# Altium project noise_toaster.PrjPcb (part 2 of 3)

## Sheet VCLPF.SchDoc
size A4
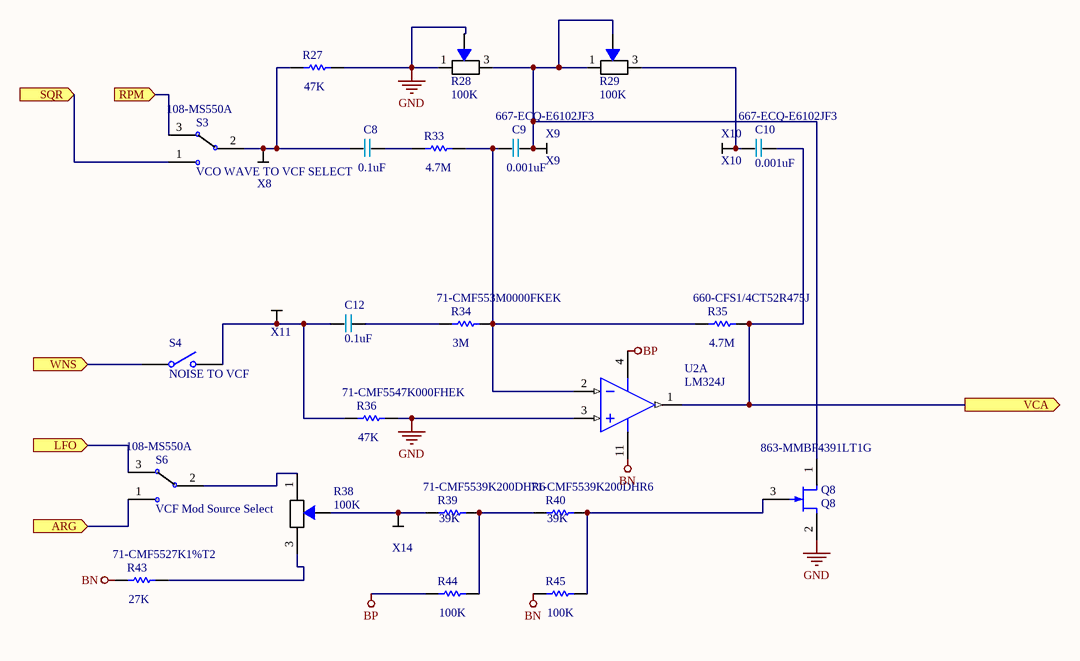
[diagram p3: VCLPF.SchDoc]

### Parts
C8  0.1uF  [Cap Film 5]
C9  Supplier Part Number 1: 667-ECQ-E6102JF3  [Cap Film 5]  (hidden comment: 0.001uF)
C10  Supplier Part Number 1: 667-ECQ-E6102JF3  [Cap Film 5]  (hidden comment: 0.001uF)
C12  0.1uF  [Cap Film 5]
Q8  Q8  Supplier Part Number 2: 863-MMBF4391LT1G  [ONSC-SOT-23-3-318-08_V]
R27  47K  [AXIAL-0.3]
R28  100K  [Potentiometer]
R29  100K  [Potentiometer]
R33  4.7M  [AXIAL-0.3]
R34  Supplier Part Number 1: 71-CMF553M0000FKEK  [AXIAL-0.3]  (hidden comment: 3M)
R35  Supplier Part Number 1: 660-CFS1/4CT52R475J  [AXIAL-0.3]  (hidden comment: 4.7M)
R36  Supplier Part Number 1: 71-CMF5547K000FHEK  [AXIAL-0.3]  (hidden comment: 47K)
R38  100K  [Potentiometer]
R39  Supplier Part Number 1: 71-CMF5539K200DHR6  [AXIAL-0.3]  (hidden comment: 39K)
R40  Supplier Part Number 1: 71-CMF5539K200DHR6  [AXIAL-0.3]  (hidden comment: 39K)
R43  Supplier Part Number 1: 71-CMF5527K1%T2  [AXIAL-0.3]  (hidden comment: 27K)
R44  100K  [AXIAL-0.3]
R45  100K  [AXIAL-0.3]
S3  VCO WAVE TO VCF SELECT  Supplier Part Number 1: 108-MS550A  [SPDT Switch]
S4  NOISE TO VCF  [SPST-2]
S6  VCF Mod Source Select  Supplier Part Number 1: 108-MS550A  [SPDT Switch]
U2  LM324J  [J14A]  (part A of 4)
X8  Pad  [Pad]  (value not drawn)
X9  X9  [Pad]
X10  X10  [Pad]
X11  X11  [Pad]  (value not drawn)
X14  X14  [Pad]  (value not drawn)

### Ports
ARG (in), LFO (in), RPM (in), SQR (in), VCA (out), WNS (in)

### Nets
BN: R43.1 R45.1 U2.11(GND)
BP: R44.1 U2.4(V+)
GND: Q8.2(S) R27.2 R28.1 R28.2 R36.2 U2.3(IN1+)
NetC2_1: S3.3 ; port RPM
NetC8_1: C8.1 R27.1 S3.2 X8.1
NetC8_2: C8.2 R33.1
NetC9_1: C9.1 R33.2 R34.2 R35.1 U2.2(IN1-)
NetC9_2: C9.2 Q8.1(D) R28.3 R29.1 R29.2 X9.1
NetC10_1: C10.1 R29.3 X10.1
NetC10_2: C10.2 R35.2 U2.1(OUT1) ; port VCA
NetC12_1: C12.1 R36.1 S4.2(NO) X11.1
NetC12_2: C12.2 R34.1
NetQ6_3: S4.1(COMMON) ; port WNS
NetQ8_3: Q8.3(G) R40.2 R45.2
NetQ9_2: S6.1 ; port ARG
NetR13_1: S6.3 ; port LFO
NetR31_2: S3.1 ; port SQR
NetR38_1: R38.1 S6.2
NetR38_2: R38.2 R39.1 X14.1
NetR38_3: R38.3 R43.2
NetR39_2: R39.2 R40.1 R44.2

### Library data of the parts
C8 C12 = Cap Film 5: Value: 0.1uF; Supplier 1: Mouser; Supplier Part Number 1: 594-K104K20X7RH53K2
C9 = Cap Film 5: Manufacturer: Panasonic; Manufacturer Part Number: ECQ-E4103KF; Capacitance: 0.01 uF; Tolerance: 5 %; Type: Metallized Polyester Film Capacitor; Voltage Rating DC: 400 VDC; Capacitance - nF: 10 nF; Capacitance - pF: 10000 pF; Dielectric: Polyester; Lead Diameter: 0.6 mm; Value: 0.001uF; Supplier 1: Mouser; RoHS: RoHS Compliant; Category: Film Capacitors; Stock 1: 175429; Pricing 1: 1=0.360, 10=0.173, 100=0.123, 500=0.111, 1000=0.093, 2000=0.088, 10000=0.077, 25000=0.074, 50000=0.066 (USD); Height: 7.4 mm; Length: 10.3 mm; Packaging: Bulk; Product: General Film Capacitors; Series: ECQE(B); Termination Style: Radial; Width: 4.3 mm; Brand: Panasonic; Lead Spacing: 7.5 mm; Maximum Operating Temperature: + 105 C; Minimum Operating Temperature: - 40 C; Standard Pack Qty: 1000; RoHS - Mouser: Y; Minimum Order Quantity: 1; Reeling: False; ComponentLink1URL: http://www.mouser.com/ds/2/315/ABD0000C179-947645.pdf; ComponentLink1Description: http://www.mouser.com/ds/2/315/ABD0000C179-947645.pdf
C10 = Cap Film 5: Manufacturer: Panasonic; Manufacturer Part Number: ECQ-E6102JF3; Capacitance: 1000 pF; Tolerance: 5 %; Type: Metallized Polyester Film Capacitor; Voltage Rating DC: 630 VDC; Capacitance - nF: 1 nF; Dielectric: Polyester; Lead Diameter: 0.6 mm; Value: 0.001uF; Supplier 1: Mouser; RoHS: RoHS Compliant; Category: Film Capacitors; Stock 1: 1487; Pricing 1: 1=0.500, 10=0.244, 100=0.174, 500=0.157, 1000=0.132, 2000=0.118, 10000=0.108, 25000=0.105, 50000=0.093 (USD); Length: 10 mm; Product: General Film Capacitors; Series: ECQE(B); Termination Style: Radial; Width: 4.5 mm; Brand: Panasonic; Number of Pins: 2; Capacitance - uF: 0.001 uF; Lead Spacing: 5 mm; Maximum Operating Temperature: + 105 C; Minimum Operating Temperature: - 40 C; Standard Pack Qty: 1000; RoHS - Mouser: Y; Minimum Order Quantity: 1; Reeling: False; ComponentLink1URL: http://www.mouser.com/ds/2/315/ABD0000C179-947645.pdf; ComponentLink1Description: http://www.mouser.com/ds/2/315/ABD0000C179-947645.pdf
Q8 = MMBF4391LT1: JFET Switching Transistor, N-Channel, 3-Pin SOT-23, Tape and Reel; Manufacturer: On Semiconductor; Manufacturer Part Number: MMBF4391LT1G; Channel Polarity: N Channel; Ciss Max (pF): 14; Crss Max (pF): 3.5; IDSS Max (uA): 150000; IDSS Min (uA): 50000; V(BR)GSS Min (V): 30; Configuration: Single; Drain-Source Current at Vgs=0: 50 mA to 150 mA; Vds - Drain-Source Breakdown Voltage: 30 V; DatasheetVersion: Rev. 10; PackageVersion: Rev. AP, 11/2009; PackageReference: SOT-23-3-318-08; PackageDescription: 3-Pin Small Outline Transistor, Body 2.92 x 1.3 mm, Pitch 0.95 mm; Supplier 1: Mouser; Supplier Part Number 1: 863-MMBF4391LT1G; Packing: Tape and Reel; Mounting Technology: Surface Mount; PartNumber: MMBF4391LT1; ComponentLink1Description: Manufacturer URL; ComponentLink1URL: http://www.onsemi.com/; ComponentLink2Description: Datasheet; ComponentLink2URL: http://www.onsemi.com/pub_link/Collateral/MMBF4391LT1-D.PDF; ComponentLink3Description: Package Specification; ComponentLink3URL: http://www.onsemi.cn/pub_link/Collateral/318-08.PDF; Supplier 2: Mouser; RoHS: RoHS Compliant; Category: JFET; Stock 2: 3330; Pricing 2: 1=0.490, 10=0.339, 100=0.156, 1000=0.120, 3000=0.102, 9000=0.093, 24000=0.087, 45000=0.078, 99000=0.075 (USD); Package / Case: SOT-23-3; Packaging: Reel; Series: MMBF4391L; Brand: ON Semiconductor; Mounting Style: SMD/SMT; Transistor Polarity: N-Channel; Standard Pack Qty: 3000; Vgs - Gate-Source Breakdown Voltage: 30 V; RoHS - Mouser: Y; Minimum Order Quantity: 1; Reeling: True; ComponentLink4URL: http://www.mouser.com/ds/2/308/MMBF4391LT1-D-108578.pdf; ComponentLink4Description: http://www.mouser.com/ds/2/308/MMBF4391LT1-D-108578.pdf
R27 = Res1: Resistor; Manufacturer Part Number: CMF5547K000FHEK; Lead Diameter: 0.64 mm; Published: 8-Jun-2000; LatestRevisionDate: 17-Jul-2002; LatestRevisionNote: Re-released for DXP Platform.; PackageReference: AXIAL-0.3; Publisher: Altium Limited; PackageDescription: Axial Device, Thru-Hole; 2 Leads; 0.3 in Pin Spacing; Value: 47K; Category: Metal Film Resistors - Through Hole; ComponentLink1Description: http://www.mouser.com/ds/2/427/cmfind-239942.pdf; ComponentLink1URL: http://www.mouser.com/ds/2/427/cmfind-239942.pdf; Diameter: 2.29 mm; Supplier 1: Mouser; Supplier Part Number 1: 71-CMF5547K000FHEK
R28 R29 R38 = Potentiometer: My Own; Manufacturer Part Number: RV09AF-40-20K-B100K; Brand: Alpha (Taiwan); Number of Gangs: 1 Gang; Number of Turns: 1 Turn; Power Rating: 100 mW; Resistance: 100 kOhms; Shaft Diameter: 6 mm; Shaft Length: 20 mm; Shaft Type: Knurled / Serrated; Tolerance: 20 %; Voltage Rating: 50 V; Value: 100K; Category: Potentiometers; Manufacturer: Alpha (Taiwan); Minimum Order Quantity: 1; Mounting Style: Panel Mount; Operating Temperature Range: - 10 C to + 70 C; Pricing 1: 1=1.32, 25=1.11, 50=1.03, 100=0.940, 500=0.790, 1000=0.660, 2500=0.550, 5000=0.500, 10000=0.450 (USD); Product: Potentiometer; Reeling: False; RoHS - Mouser: Y; RoHS: RoHS Compliant; Standard Pack Qty: 1000; Stock 1: 13035; Supplier 1: Mouser; Supplier Part Number 1: 317-2090F-100K; Taper: Linear; Termination Style: Through Hole; Type: Rotary
R33 = Res1: Resistor; Published: 8-Jun-2000; LatestRevisionDate: 17-Jul-2002; LatestRevisionNote: Re-released for DXP Platform.; PackageReference: AXIAL-0.3; Publisher: Altium Limited; PackageDescription: Axial Device, Thru-Hole; 2 Leads; 0.3 in Pin Spacing; Value: 4.7M; Supplier 1: Mouser; Supplier Part Number 1: 660-CFS1/4CT52R475J
R34 = Res1: Resistor; Manufacturer: Vishay / Dale; Manufacturer Part Number: CMF553M0000FKEK; Power Rating: 500 mW (1/2 W); Resistance: 3 MOhms; Temperature Coefficient: 100 PPM / C; Tolerance: 1 %; Voltage Rating: 250 V; Lead Diameter: 0.64 mm; Published: 8-Jun-2000; LatestRevisionDate: 17-Jul-2002; LatestRevisionNote: Re-released for DXP Platform.; PackageReference: AXIAL-0.3; Publisher: Altium Limited; PackageDescription: Axial Device, Thru-Hole; 2 Leads; 0.3 in Pin Spacing; Value: 3M; Supplier 1: Mouser; RoHS: RoHS Compliant; Category: Metal Film Resistors - Through Hole; Stock 1: 575; Pricing 1: 1=0.510, 50=0.503, 100=0.493, 500=0.481, 1000=0.418, 2000=0.405, 5000=0.393, 10000=0.381, 25000=0.380 (USD); Diameter: 2.29 mm; Length: 6.1 mm; Operating Temperature Range: - 55 C to + 175 C; Packaging: Bulk; Product: Metal Film Resistors Controlled Temp Coefficient; Series: CMF Industrial; Termination Style: Axial; Type: Metal Film Resistors, Industrial, Precision; Brand: Vishay / Dale; Standard Pack Qty: 100; RoHS - Mouser: Y; Minimum Order Quantity: 1; Reeling: False; ComponentLink1URL: http://www.mouser.com/ds/2/427/cmfind-239942.pdf; ComponentLink1Description: http://www.mouser.com/ds/2/427/cmfind-239942.pdf
R35 = Res1: Resistor; Manufacturer: KOA Speer; Manufacturer Part Number: CFS1/4CT52R475J; Power Rating: 250 mW (1/4 W); Resistance: 4.7 MOhms; Tolerance: 5 %; Voltage Rating: 250 V; Qualification: AEC-Q200; Published: 8-Jun-2000; LatestRevisionDate: 17-Jul-2002; LatestRevisionNote: Re-released for DXP Platform.; PackageReference: AXIAL-0.3; Publisher: Altium Limited; PackageDescription: Axial Device, Thru-Hole; 2 Leads; 0.3 in Pin Spacing; Value: 4.7M; Supplier 1: Mouser; RoHS: RoHS Compliant; Category: Carbon Film Resistors - Through Hole; Stock 1: 14824; Pricing 1: 1=0.150, 5000=0.030, 10000=0.018, 50000=0.014, 100000=0.010 (USD); Diameter: 1.7 mm; Length: 3.2 mm; Operating Temperature Range: - 55 C to + 155 C; Packaging: Reel; Series: CF; Termination Style: Axial; Type: Carbon Film Leaded Resistor; Brand: KOA Speer; Standard Pack Qty: 5000; RoHS - Mouser: Y; Minimum Order Quantity: 1; Reeling: True; ComponentLink1URL: http://www.mouser.com/ds/2/219/CF-6922.pdf; ComponentLink1Description: http://www.mouser.com/ds/2/219/CF-6922.pdf
R36 = Res1: Resistor; Manufacturer: Vishay / Dale; Manufacturer Part Number: CMF5547K000FHEK; Power Rating: 500 mW (1/2 W); Resistance: 47 kOhms; Temperature Coefficient: 50 PPM / C; Tolerance: 1 %; Voltage Rating: 250 V; Lead Diameter: 0.64 mm; Published: 8-Jun-2000; LatestRevisionDate: 17-Jul-2002; LatestRevisionNote: Re-released for DXP Platform.; PackageReference: AXIAL-0.3; Publisher: Altium Limited; PackageDescription: Axial Device, Thru-Hole; 2 Leads; 0.3 in Pin Spacing; Value: 47K; Supplier 1: Mouser; RoHS: RoHS Compliant; Category: Metal Film Resistors - Through Hole; Stock 1: 569; Pricing 1: 1=0.420, 25=0.242, 100=0.152, 500=0.131, 1000=0.100, 2000=0.093, 5000=0.084 (USD); Diameter: 2.29 mm; Length: 6.1 mm; Operating Temperature Range: - 55 C to + 175 C; Packaging: Bulk; Product: Metal Film Resistors Controlled Temp Coefficient; Series: CMF Industrial; Termination Style: Axial; Type: Metal Film Resistors, Industrial, Precision; Brand: Vishay / Dale; Standard Pack Qty: 100; RoHS - Mouser: Y; Minimum Order Quantity: 1; Reeling: False; ComponentLink1URL: http://www.mouser.com/ds/2/427/cmfind-239942.pdf; ComponentLink1Description: http://www.mouser.com/ds/2/427/cmfind-239942.pdf
R39 R40 = Res1: Resistor; Manufacturer: Vishay / Dale; Manufacturer Part Number: CMF5539K200DHR6; Power Rating: 500 mW (1/2 W); Resistance: 39.2 kOhms; Temperature Coefficient: 50 PPM / C; Tolerance: 0.5 %; Voltage Rating: 250 V; Published: 8-Jun-2000; LatestRevisionDate: 17-Jul-2002; LatestRevisionNote: Re-released for DXP Platform.; PackageReference: AXIAL-0.3; Publisher: Altium Limited; PackageDescription: Axial Device, Thru-Hole; 2 Leads; 0.3 in Pin Spacing; Value: 39K; Supplier 1: Mouser; RoHS: No; Category: Metal Film Resistors - Through Hole; Stock 1: 502; Pricing 1: 1=0.230, 50=0.225, 100=0.220, 500=0.193, 1000=0.181, 4000=0.171, 8000=0.160, 12000=0.146, 20000=0.135 (USD); Diameter: 2.29 mm; Length: 6.1 mm; Operating Temperature Range: - 55 C to + 175 C; Packaging: Reel; Product: Metal Film Resistors Controlled Temp Coefficient; Series: CMF Industrial; Termination Style: Axial; Type: Metal Film Resistors, Industrial, Precision; Brand: Vishay / Dale; Standard Pack Qty: 1000; RoHS - Mouser: N; Minimum Order Quantity: 1; Reeling: True; ComponentLink1URL: http://www.mouser.com/ds/2/427/cmfind-239942.pdf; ComponentLink1Description: http://www.mouser.com/ds/2/427/cmfind-239942.pdf
R43 = Res1: Resistor; Manufacturer: Vishay / Dale; Manufacturer Part Number: CMF5527K000FHBF; Power Rating: 500 mW (1/2 W); Resistance: 27 kOhms; Temperature Coefficient: 50 PPM / C; Tolerance: 1 %; Voltage Rating: 250 V; Lead Diameter: 0.64 mm; Published: 8-Jun-2000; LatestRevisionDate: 17-Jul-2002; LatestRevisionNote: Re-released for DXP Platform.; PackageReference: AXIAL-0.3; Publisher: Altium Limited; PackageDescription: Axial Device, Thru-Hole; 2 Leads; 0.3 in Pin Spacing; Value: 27K; Supplier 1: Mouser; RoHS: No; Category: Metal Film Resistors - Through Hole; Stock 1: 827; Pricing 1: 1=0.230, 100=0.179, 300=0.168, 500=0.158, 1000=0.120, 2000=0.110, 11000=0.090, 23000=0.080 (USD); Diameter: 2.29 mm; Length: 6.1 mm; Operating Temperature Range: - 55 C to + 175 C; Packaging: Bulk; Product: Metal Film Resistors Controlled Temp Coefficient; Series: CMF Industrial; Termination Style: Axial; Type: Metal Film Resistors, Industrial, Precision; Brand: Vishay / Dale; Standard Pack Qty: 100; RoHS - Mouser: N; Minimum Order Quantity: 1; Reeling: False; ComponentLink1URL: http://www.mouser.com/ds/2/427/cmfind-239942.pdf; ComponentLink1Description: http://www.mouser.com/ds/2/427/cmfind-239942.pdf
R44 R45 = Res1: Resistor; Manufacturer Part Number: CMF55100K00FHEK; Brand: Vishay / Dale; Lead Diameter: 0.64 mm; Power Rating: 500 mW (1/2 W); Resistance: 100 kOhms; Temperature Coefficient: 50 PPM / C; Tolerance: 1 %; Voltage Rating: 250 V; Published: 8-Jun-2000; LatestRevisionDate: 17-Jul-2002; LatestRevisionNote: Re-released for DXP Platform.; PackageReference: AXIAL-0.3; Publisher: Altium Limited; PackageDescription: Axial Device, Thru-Hole; 2 Leads; 0.3 in Pin Spacing; Value: 100K; Category: Metal Film Resistors - Through Hole; ComponentLink1Description: http://www.mouser.com/ds/2/427/cmfind-239942.pdf; ComponentLink1URL: http://www.mouser.com/ds/2/427/cmfind-239942.pdf; Diameter: 2.29 mm; Length: 6.1 mm; Manufacturer: Vishay / Dale; Minimum Order Quantity: 1; Operating Temperature Range: - 55 C to + 175 C; Packaging: Bulk; Pricing 1: 1=0.230, 25=0.181, 100=0.132, 500=0.115, 1000=0.099, 2000=0.092, 5000=0.087, 10000=0.082, 25000=0.072 (USD); Product: Metal Film Resistors Controlled Temp Coefficient; Reeling: False; RoHS - Mouser: Y; RoHS: RoHS Compliant; Series: CMF Industrial; Standard Pack Qty: 100; Stock 1: 4041; Supplier 1: Mouser; Supplier Part Number 1: 71-CMF55100K00FHEK; Termination Style: Axial; Type: Metal Film Resistors, Industrial, Precision; Supplier Part Number 2: 71-CMF55100K00BEEB
S3 S6 = SPDT Switch: Manufacturer: Mountain Switch; Actuator: Paddle; Bushing Size: M6; Switch Function: ON - ON; Voltage Rating AC: 125 VAC; Product Status: Not Recommended for New Designs; Supplier 1: Mouser; Manufacturer Part Number: 108-MS550A; RoHS: No; Category: Toggle Switches; Stock 1: 531; Pricing 1: 1=2.15, 50=2.09, 100=2.03, 500=1.97, 1000=1.80, 2000=1.71, 5000=1.63 (USD); Contact Form: SPDT; Contact Plating: Gold; Mounting Type: Bushing; Packaging: Bulk; Series: 108; Terminal Seal: Sealed; Termination Style: Solder Lug; Type: Toggle Switches; Brand: Mountain Switch; Contact Material: Nickel; Mounting Style: Panel; Standard Pack Qty: 100; RoHS - Mouser: N; Minimum Order Quantity: 1; Reeling: False; ComponentLink1URL: http://www.mouser.com/ds/2/221/MS-200272-200731.pdf; ComponentLink1Description: http://www.mouser.com/ds/2/221/MS-200272-200731.pdf
S4 = SW-SPST: Single-Pole, Single-Throw Switch; Published: 24-Mar-1999; LatestRevisionDate: 17-Jul-2002; LatestRevisionNote: Re-released for DXP Platform.; PackageReference: SPST-2; Publisher: Altium Limited; PackageDescription: Switch; 2 Leads; Supplier 1: Mouser; Supplier Part Number 1: 108-MS550K
U2 = LM324J: Low Power Quad Operational Amplifier, 14-pin CerDIP; Manufacturer: National Semiconductor; PackageTopMarking: NSUZXYYTT*LM324J; PowerWise: N; CompType: Amplifiers; High-Reliability: Y; DatasheetVersion: Aug-2000; PackageVersion: revJ, Jul-2002; PackageReference: J14A; PackageDescription: Cerdip, .400 x .310in Body, 14 Lead, .300in Centers, .100in Pitch; PartNumber: LM324J; RoHS: N; PinCount: 14; ComponentLink1Description: Manufacturer URL; ComponentLink1URL: http://www.national.com/; ComponentLink2Description: LM324 Datasheet; ComponentLink2URL: http://www.national.com/ds/LM/LM324.pdf; ComponentLink3Description: LM324 Web Page; ComponentLink3URL: http://www.national.com/pf/LM/LM324.html; ComponentLink4Description: J14A Package Page; ComponentLink4URL: http://www.national.com/packaging/folders/j14a.html; Supplier 1: Mouser; Supplier Part Number 1: 512-LM324N
X9-X11 X14 = Pad

## Sheet LFO.SchDoc
size A4
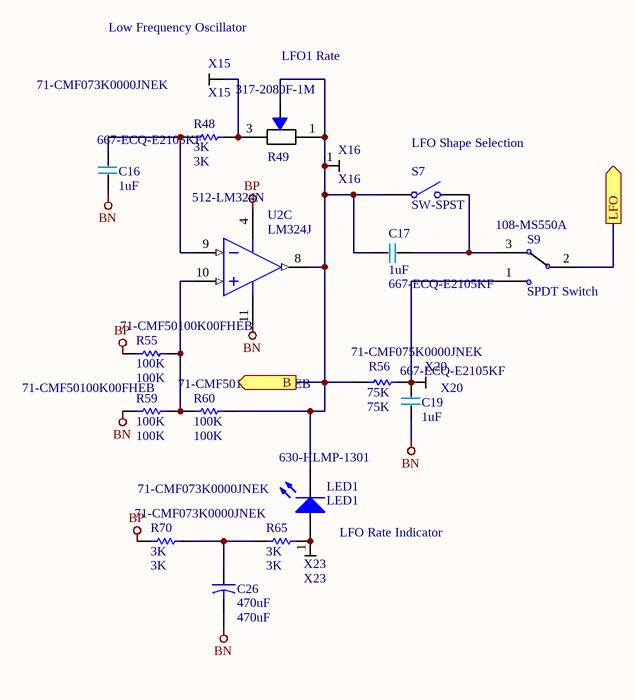
[diagram p4: LFO.SchDoc]

### Parts
C16  Supplier Part Number 1: 667-ECQ-E2105KF  [Cap Film 5]  (hidden comment: 1uF)
C17  Supplier Part Number 1: 667-ECQ-E2105KF  [Cap Film 5]  (hidden comment: 1uF)
C19  Supplier Part Number 1: 667-ECQ-E2105KF  [Cap Film 5]  (hidden comment: 1uF)
C26  470uF  [CAPR5-4X5]
LED1  LED1  Supplier Part Number 1: 630-HLMP-1301  [LED-0]
R48  3K  Supplier Part Number 1: 71-CMF073K0000JNEK  [AXIAL-0.3]
R49  Supplier Part Number 1: 317-2080F-1M  [Potentiometer]  (hidden comment: 1M)
R55  100K  Supplier Part Number 2: 71-CMF50100K00FHEB  [AXIAL-0.3]
R56  75K  Supplier Part Number 1: 71-CMF075K0000JNEK  [AXIAL-0.3]
R59  100K  Supplier Part Number 2: 71-CMF50100K00FHEB  [AXIAL-0.3]
R60  100K  Supplier Part Number 2: 71-CMF50100K00FHEB  [AXIAL-0.3]
R65  3K  Supplier Part Number 1: 71-CMF073K0000JNEK  [AXIAL-0.3]
R70  3K  Supplier Part Number 1: 71-CMF073K0000JNEK  [AXIAL-0.3]
S7  SW-SPST  [SPST-2]
S9  SPDT Switch  Supplier Part Number 1: 108-MS550A  [SPDT Switch]
U2  LM324J  Supplier Part Number 1: 512-LM324N  [J14A]  (part C of 4)
X15  X15  [Pad]
X16  X16  [Pad]
X20  X20  [Pad]
X23  X23  [Pad]

### Ports
B (out), LFO (out)

### Nets
BN: C16.1 C19.1 C26.2 R59.1 U2.11(GND)
BP: R55.1 R70.1 U2.4(V+)
NetC16_2: C16.2 R48.1 U2.9(IN3-)
NetC17_1: C17.1 S7.2(NO) S9.3
NetC17_2: C17.2 LED1.2(K) R49.1 R49.2 R56.1 R60.2 S7.1(COMMON) U2.8(OUT3) X16.1 ; port B
NetC19_2: C19.2 R56.2 S9.1 X20.1
NetC26_1: C26.1 R65.1 R70.2
NetLED1_1: LED1.1(A) R65.2 X23.1
NetR13_1: S9.2 ; port LFO
NetR48_2: R48.2 R49.3 X15.1
NetR55_2: R55.2 R59.2 R60.1 U2.10(IN3+)

### Notes on the sheet
- (near X15) Low Frequency Oscillator
- LFO1 Rate
- (near S7) LFO Shape Selection
- LFO Rate Indicator

### Library data of the parts
C16 C17 C19 = Cap Film 5: Manufacturer: Panasonic; Manufacturer Part Number: ECQ-E2105KF; Tolerance: 10 %; Type: Metallized Polyester Film Capacitor; Voltage Rating DC: 250 VDC; Capacitance - nF: 1000 nF; Dielectric: Polyester; Lead Diameter: 0.8 mm; Value: 1uF; Supplier 1: Mouser; RoHS: RoHS Compliant; Category: Film Capacitors; Stock 1: 10797; Pricing 1: 1=0.680, 10=0.361, 100=0.268, 500=0.233, 1000=0.198, 2000=0.186, 10000=0.160, 25000=0.157, 50000=0.150 (USD); Capacitance: 1 uF; Height: 15 mm; Length: 18.5 mm; Packaging: Bulk; Product: General Film Capacitors; Series: ECQE(B); Termination Style: Radial; Width: 7.4 mm; Brand: Panasonic; Lead Spacing: 15 mm; Maximum Operating Temperature: + 105 C; Minimum Operating Temperature: - 40 C; Standard Pack Qty: 1000; RoHS - Mouser: Y; Minimum Order Quantity: 1; Reeling: False; ComponentLink1URL: http://www.mouser.com/ds/2/315/ABD0000C179-947645.pdf; ComponentLink1Description: http://www.mouser.com/ds/2/315/ABD0000C179-947645.pdf
C26 = Cap2: Capacitor; Value: 470uF; Published: 23-Sep-2002; PackageReference: CAPR5-4X5; Publisher: Altium Limited; PackageDescription: Capacitor; 2 Leads; Supplier 1: Mouser; Supplier Part Number 1: 667-ECA-1VM471
LED1 = LED0: Typical INFRARED GaAs LED; Manufacturer: Broadcom / Avago; Illumination Color: Red; Lens Color/Style: Tinted, Diffused; Wavelength: 635 nm; LED Size: T-1 (3 mm); Lens Shape: Dome; Luminous Intensity: 3.4 mcd; Viewing Angle: 60 deg; If - Forward Current: 10 mA; Operating Supply Voltage: 1.9 V; Published: 8-Jun-2000; LatestRevisionDate: 08-Jul-2005; LatestRevisionNote: Mech Layer 1 removed.; PackageReference: LED-0; Publisher: Altium Limited; PackageDescription: LED; 2 Leads; Supplier 1: Mouser; Manufacturer Part Number: HLMP-1301; RoHS: RoHS Compliant; Category: Standard LEDs - Through Hole; Stock 1: 32479; Pricing 1: 1=0.370, 10=0.240, 100=0.138, 1000=0.108, 2000=0.090, 10000=0.084, 24000=0.082, 50000=0.079, 100000=0.075 (USD); Package / Case: T-1 (3 mm); Packaging: Bulk; Brand: Broadcom / Avago; Mounting Style: Through Hole; Lens Dimensions: 3 mm; Maximum Operating Temperature: + 100 C; Minimum Operating Temperature: - 40 C; Standard Pack Qty: 2000; Vf - Forward Voltage: 1.9 V; Wavelength/Color Temperature: 635 nm; RoHS - Mouser: Y; Minimum Order Quantity: 1; Reeling: False
R48 R65 R70 = Res1: Resistor; Manufacturer: Vishay / Dale; Manufacturer Part Number: CMF073K0000JNEK; Power Rating: 500 mW (1/2 W); Resistance: 3 kOhms; Temperature Coefficient: 200 PPM / C; Tolerance: 5 %; Voltage Rating: 250 V; Lead Diameter: 0.64 mm; Published: 8-Jun-2000; LatestRevisionDate: 17-Jul-2002; LatestRevisionNote: Re-released for DXP Platform.; PackageReference: AXIAL-0.3; Publisher: Altium Limited; PackageDescription: Axial Device, Thru-Hole; 2 Leads; 0.3 in Pin Spacing; Value: 3K; Supplier 1: Mouser; RoHS: RoHS Compliant; Category: Metal Film Resistors - Through Hole; Stock 1: 1543; Pricing 1: 1=0.450, 25=0.324, 50=0.198, 100=0.147, 500=0.106, 1000=0.082, 2500=0.078, 5000=0.077, 10000=0.075 (USD); Diameter: 2.29 mm; Length: 6.1 mm; Operating Temperature Range: - 55 C to + 175 C; Packaging: Bulk; Product: Metal Film Resistors Controlled Temp Coefficient; Series: CMF Industrial; Termination Style: Axial; Type: Metal Film Resistors, Industrial, Precision; Brand: Vishay / Dale; Standard Pack Qty: 100; RoHS - Mouser: Y; Minimum Order Quantity: 1; Reeling: False; ComponentLink1URL: http://www.mouser.com/ds/2/427/cmfind-239942.pdf; ComponentLink1Description: http://www.mouser.com/ds/2/427/cmfind-239942.pdf
R49 = Potentiometer: My Own; Manufacturer: Alpha (Taiwan); Manufacturer Part Number: RV09AF-40-20K-A16; Power Rating: 50 mW; Resistance: 1 MOhms; Tolerance: 20 %; Voltage Rating: 50 V; Number of Gangs: 1 Gang; Number of Turns: 1 Turn; Shaft Diameter: 6 mm; Shaft Length: 20 mm; Shaft Type: Knurled / Serrated; Supplier 1: Mouser; RoHS: RoHS Compliant; Category: Potentiometers; Stock 1: 740; Pricing 1: 1=1.32, 25=1.11, 50=1.03, 100=0.940, 500=0.790, 1000=0.660, 2500=0.550, 5000=0.500, 10000=0.450 (USD); Operating Temperature Range: - 10 C to + 70 C; Product: Potentiometer; Termination Style: Through Hole; Type: Rotary; Brand: Alpha (Taiwan); Mounting Style: Panel Mount; Standard Pack Qty: 1000; Taper: Audio; RoHS - Mouser: Y; Minimum Order Quantity: 1; Reeling: False; Value: 1M
R55 R59 R60 = Res1: as R44 on sheet VCLPF; Published: 8-Jun-2000; LatestRevisionDate: 17-Jul-2002; LatestRevisionNote: Re-released for DXP Platform.; PackageReference: AXIAL-0.3; Publisher: Altium Limited; PackageDescription: Axial Device, Thru-Hole; 2 Leads; 0.3 in Pin Spacing; Value: 100K; Category: Metal Film Resistors - Through Hole; ComponentLink1Description: http://www.mouser.com/ds/2/427/cmfind-239942.pdf; ComponentLink1URL: http://www.mouser.com/ds/2/427/cmfind-239942.pdf; Diameter: 2.29 mm; Length: 6.1 mm; Manufacturer: Vishay / Dale; Minimum Order Quantity: 1; Operating Temperature Range: - 55 C to + 175 C; Packaging: Bulk; Pricing 1: 1=0.230, 25=0.181, 100=0.132, 500=0.115, 1000=0.099, 2000=0.092, 5000=0.087, 10000=0.082, 25000=0.072 (USD); Product: Metal Film Resistors Controlled Temp Coefficient; Reeling: False; RoHS - Mouser: Y; RoHS: RoHS Compliant; Series: CMF Industrial; Standard Pack Qty: 100; Stock 1: 4041; Supplier 1: Mouser; Supplier Part Number 1: 71-CMF50100K00FHEB; Termination Style: Axial; Type: Metal Film Resistors, Industrial, Precision; Stock 2: 935; Pricing 2: 1=0.770, 10=0.460, 50=0.400, 100=0.287, 500=0.233, 1000=0.168, 2000=0.163, 5000=0.160, 10000=0.153 (USD)
R56 = Res1: Resistor; Manufacturer: Yageo; Manufacturer Part Number: FMP200FRF52-75K; Power Rating: 500 mW (1/2 W); Resistance: 5 kOhms; Temperature Coefficient: 200 PPM / C; Tolerance: 5 %; Voltage Rating: 250 V; Brand: Vishay / Dale; Lead Diameter: 0.64 mm; Published: 8-Jun-2000; LatestRevisionDate: 17-Jul-2002; LatestRevisionNote: Re-released for DXP Platform.; PackageReference: AXIAL-0.3; Publisher: Altium Limited; PackageDescription: Axial Device, Thru-Hole; 2 Leads; 0.3 in Pin Spacing; Value: 75K; Supplier 1: Mouser; RoHS: RoHS Compliant; Category: Metal Film Resistors - Through Hole; Stock 1: 227; Pricing 1: 1=0.320, 25=0.300, 50=0.184, 100=0.116, 500=0.099, 1000=0.076, 2500=0.071, 5000=0.064 (USD); Diameter: 2.29 mm; Length: 6.1 mm; Operating Temperature Range: - 55 C to + 175 C; Packaging: Bulk; Product: Metal Film Resistors Controlled Temp Coefficient; Series: CMF Industrial; Termination Style: Axial; Type: Metal Film Resistors, Industrial, Precision; Standard Pack Qty: 100; RoHS - Mouser: Y; Minimum Order Quantity: 1; Reeling: False; ComponentLink1URL: http://www.mouser.com/ds/2/427/cmfind-239942.pdf; ComponentLink1Description: http://www.mouser.com/ds/2/427/cmfind-239942.pdf
S7 = SW-SPST: Single-Pole, Single-Throw Switch; Published: 24-Mar-1999; LatestRevisionDate: 17-Jul-2002; LatestRevisionNote: Re-released for DXP Platform.; PackageReference: SPST-2; Publisher: Altium Limited; PackageDescription: Switch; 2 Leads; Supplier 1: Mouser; Supplier Part Number 1: 108-MS550K
S9 = SPDT Switch: as S3 on sheet VCLPF; Supplier 1: Mouser; Manufacturer Part Number: 108-MS550A; RoHS: No; Category: Toggle Switches; Stock 1: 531; Pricing 1: 1=2.15, 50=2.09, 100=2.03, 500=1.97, 1000=1.80, 2000=1.71, 5000=1.63 (USD); Contact Form: SPDT; Contact Plating: Gold; Mounting Type: Bushing; Packaging: Bulk; Series: 108; Terminal Seal: Sealed; Termination Style: Solder Lug; Type: Toggle Switches; Brand: Mountain Switch; Contact Material: Nickel; Mounting Style: Panel; Standard Pack Qty: 100; RoHS - Mouser: N; Minimum Order Quantity: 1; Reeling: False; ComponentLink1URL: http://www.mouser.com/ds/2/221/MS-200272-200731.pdf; ComponentLink1Description: http://www.mouser.com/ds/2/221/MS-200272-200731.pdf
U2 = LM324J: Low Power Quad Operational Amplifier, 14-pin CerDIP; Manufacturer: National Semiconductor; Manufacturer Part Number: LM324N; PackageTopMarking: NSUZXYYTT*LM324J; PowerWise: N; CompType: Amplifiers; High-Reliability: Y; Amplifier Type: High Gain Amplifier; Input Type: Rail-to-Rail; Supply Type: Single, Dual; Brand: ON Semiconductor / Fairchild; Number of Channels: 4 Channel; Shutdown: No Shutdown; CMRR - Common Mode Rejection Ratio: 65 dB; Dual Supply Voltage: +/- 3 V, +/- 5 V, +/- 9 V; Ib - Input Bias Current: 250 nA; Maximum Dual Supply Voltage: +/- 16 V; Minimum Dual Supply Voltage: +/- 1.5 V; Operating Supply Current: 175 uA; Operating Supply Voltage: 3 V to 32 V, +/- 1.5 V to +/- 16 V; Output Current per Channel: 40 mA; Pd - Power Dissipation: 1310 mW; Supply Voltage - Max: 32 V; Supply Voltage - Min: 3 V; Voltage Gain dB: 100 dB; Vos - Input Offset Voltage: 7 mV; DatasheetVersion: Aug-2000; PackageVersion: revJ, Jul-2002; PackageReference: J14A; PackageDescription: Cerdip, .400 x .310in Body, 14 Lead, .300in Centers, .100in Pitch; PartNumber: LM324J; RoHS: N; PinCount: 14; ComponentLink1Description: Manufacturer URL; ComponentLink1URL: http://www.national.com/; ComponentLink2Description: LM324 Datasheet; ComponentLink2URL: http://www.national.com/ds/LM/LM324.pdf; ComponentLink3Description: LM324 Web Page; ComponentLink3URL: http://www.national.com/pf/LM/LM324.html; ComponentLink4Description: J14A Package Page; ComponentLink4URL: http://www.national.com/packaging/folders/j14a.html; Supplier 1: Mouser; Category: Operational Amplifiers - Op Amps; Stock 1: 11024; Pricing 1: 1=0.460, 10=0.380, 100=0.232, 1000=0.179, 2500=0.153, 10000=0.143, 25000=0.135, 50000=0.132 (USD); Height: 3.56 mm (Max); Length: 19.56 mm (Max); Package / Case: DIP-14; Packaging: Tube; Product: Operational Amplifiers; Series: LM324; Technology: Bipolar; Width: 6.6 mm (Max); Mounting Style: Through Hole; Maximum Operating Temperature: + 70 C; Minimum Operating Temperature: 0 C; PSRR - Power Supply Rejection Ratio: 65 dB; Standard Pack Qty: 25; RoHS - Mouser: Y; Minimum Order Quantity: 1; Reeling: False; ComponentLink5URL: http://www.mouser.com/ds/2/308/LM324-1120928.pdf; ComponentLink5Description: http://www.mouser.com/ds/2/308/LM324-1120928.pdf
X15 X16 X20 X23 = Pad

## Sheet attac_decay_generator.SchDoc
size A4
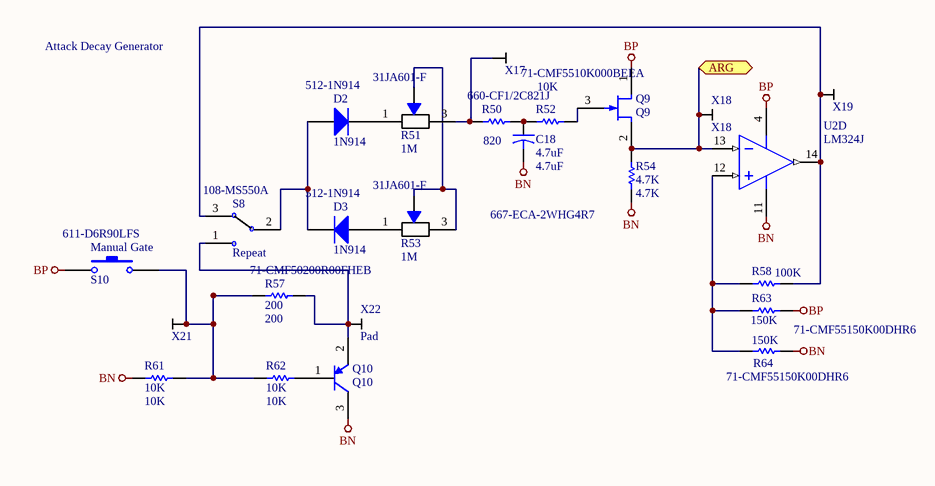
[diagram p5: attac_decay_generator.SchDoc]

### Parts
C18  4.7uF  Supplier Part Number 1: 667-ECA-2WHG4R7  [CAPR5-4X5]
D2  1N914  Supplier Part Number 1: 512-1N914  [DO-35]
D3  1N914  Supplier Part Number 1: 512-1N914  [DO-35]
Manual_Gate  S10  Supplier Part Number 1: 611-D6R90LFS  [SPST-2]
Q9  Q9  [ONSC-SOT-23-3-318-08_V]
Q10  Q10  [ONSC-SC-75-3-463-01_V]
R50  value 820  Supplier Part Number 1: 660-CF1/2C821J  [AXIAL-0.3]  (hidden comment: Res1820)
R51  value 1M  Supplier Part Number 1: 31JA601-F  [Potentiometer]  (hidden comment: 1M Pot)
R52  Supplier Part Number 2: 71-CMF5510K000BEEA  [AXIAL-0.3]  (hidden comment: 10K)
R53  Supplier Part Number 1: 31JA601-F  [Potentiometer]  (hidden comment: 1M)
R54  4.7K  [AXIAL-0.3]
R57  200  Supplier Part Number 1: 71-CMF50200R00FHEB  [AXIAL-0.3]
R58  100K  [AXIAL-0.3]
R61  10K  [AXIAL-0.3]
R62  10K  [AXIAL-0.3]
R63  Supplier Part Number 1: 71-CMF55150K00DHR6  [AXIAL-0.3]  (hidden comment: 150K)
R64  Supplier Part Number 1: 71-CMF55150K00DHR6  [AXIAL-0.3]  (hidden comment: 150K)
S8  Repeat  Supplier Part Number 1: 108-MS550A  [SPDT Switch]
U2  LM324J  [J14A]  (part D of 4)
X17  X17  [Pad]  (value not drawn)
X18  X18  [Pad]
X19  X19  [Pad]  (value not drawn)
X21  X21  [Pad]  (value not drawn)
X22  Pad  [Pad]

### Ports
ARG (bidir)

### Nets
BN: C18.2 Q10.3(C) R54.1 R61.1 R64.2 U2.11(GND)
BP: Manual_Gate.1 Q9.1(D) R63.2 U2.4(V+)
NetC18_1: C18.1 R50.2 R52.1
NetD2_1: D2.1(A) D3.2(K) S8.2
NetD2_2: D2.2(K) R51.1
NetD3_1: D3.1(A) R53.1
NetManual_Gate_2: Manual_Gate.2 R57.1 R61.2 R62.1 X21.1
NetQ9_2: Q9.2(S) R54.2 U2.13(IN4-) X18.1 ; port ARG
NetQ9_3: Q9.3(G) R52.2
NetQ10_1: Q10.1(B) R62.2
NetQ10_2: Q10.2(E) R57.2 S8.1 X22.1
NetR50_1: R50.1 R51.3 X17.1
NetR51_2: R51.2 R53.2 R53.3
NetR58_1: R58.1 R63.1 R64.1 U2.12(IN4+)
NetR58_2: R58.2 S8.3 U2.14(OUT4) X19.1

### Notes on the sheet
- Attack Decay Generator

### Library data of the parts
C18 = Cap2: Capacitor; Manufacturer: Panasonic; Manufacturer Part Number: ECA-2WHG4R7; Tolerance: 20 %; Type: Radial Lead Type; Voltage Rating DC: 450 VDC; Leakage Current: 10 uA; Capacitance - nF: 4700 nF; Dissipation Factor DF: 0.24; Life: 2000 Hour; Ripple Current: 49 mA; Published: 23-Sep-2002; PackageReference: CAPR5-4X5; Publisher: Altium Limited; PackageDescription: Capacitor; 2 Leads; Value: 4.7uF; Supplier 1: Mouser; RoHS: RoHS Compliant; Category: Aluminum Electrolytic Capacitors - Leaded; Stock 1: 5633; Pricing 1: 1=0.630, 10=0.372, 100=0.292, 500=0.252, 1000=0.212, 2500=0.199, 10000=0.180, 25000=0.173, 50000=0.166 (USD); Capacitance: 4.7 uF; Diameter: 10 mm; Length: 20 mm; Package / Case: Radial, Can; Packaging: Bulk; Product: General Purpose Electrolytic Capacitors; Series: NHG; Termination Style: Radial; Brand: Panasonic; Lead Spacing: 5 mm; Lead Style: Straight; Maximum Operating Temperature: + 105 C; Minimum Operating Temperature: - 25 C; Standard Pack Qty: 200; RoHS - Mouser: Y; Minimum Order Quantity: 1; Reeling: False; ComponentLink1URL: http://www.mouser.com/ds/2/315/ABA0000C1215-1109177.pdf; ComponentLink1Description: http://www.mouser.com/ds/2/315/ABA0000C1215-1109177.pdf
D2 D3 = Diode 1N914: High Conductance Fast Diode; Manufacturer: ON Semiconductor / Fairchild; Configuration: Single; Type: Small Signal Switching Diode; Max Surge Current: 4 A; Recovery Time: 4 ns; If - Forward Current: 0.3 A; Ir - Reverse Current: 5 uA; Peak Reverse Voltage: 100 V; Vf - Forward Voltage: 1 V at 0.01 A; Published: 8-Jun-2000; LatestRevisionDate: 17-Jul-2002; LatestRevisionNote: Re-released for DXP Platform.; DatasheetVersion: 1997; PackageReference: DO-35; Publisher: Altium Limited; PackageDescription: Diode, Axial; Body 3.8 x 1.9 mm (LxDia. max), Lead Dia. 0.53 mm (max); Code_JEDEC: DO-204-AH; ComponentLink1Description: Manufacturer Link; ComponentLink1URL: http://www.fairchildsemi.com/; ComponentLink2Description: Datasheet; ComponentLink2URL: http://www.fairchildsemi.com/ds/1N%2F1N4448.pdf; Supplier 1: Mouser; Manufacturer Part Number: 1N914; RoHS: RoHS Compliant; Category: Diodes - General Purpose, Power, Switching; Stock 1: 44120; Pricing 1: 1=0.100, 10=0.075, 100=0.027, 1000=0.018, 2500=0.014, 10000=0.012, 25000=0.011, 50000=0.010, 100000=0.008 (USD); Height: 1.91 mm; Length: 4.56 mm; Package / Case: DO-35; Packaging: Bulk; Product: Switching Diodes; Series: 1N914; Width: 1.91 mm; Brand: ON Semiconductor / Fairchild; Mounting Style: Through Hole; Maximum Operating Temperature: + 175 C; Minimum Operating Temperature: - 65 C; Standard Pack Qty: 2000; Vr - Reverse Voltage: 100 V; RoHS - Mouser: Y; Minimum Order Quantity: 1; Reeling: False; ComponentLink3URL: http://www.mouser.com/ds/2/308/1N914-1118223.pdf; ComponentLink3Description: http://www.mouser.com/ds/2/308/1N914-1118223.pdf
Manual_Gate = SW-PB: Switch; Manufacturer: C&K Components; Manufacturer Part Number: D6R90 F1 LFS; Actuator: Round; Contact Form: SPST; Current Rating: 100 mA; Power Rating: 3 VA; Switch Function: ON - (OFF); Voltage Rating DC: 32 VDC; Published: 24-Mar-1999; LatestRevisionDate: 17-Jul-2002; LatestRevisionNote: Re-released for DXP Platform.; PackageReference: SPST-2; Publisher: Altium Limited; PackageDescription: Switch; 2 Leads; Supplier 1: Mouser; RoHS: RoHS Compliant; Category: Pushbutton Switches; Stock 1: 8406; Pricing 1: 1=0.770, 25=0.731, 50=0.694, 100=0.676, 250=0.658, 500=0.621, 1000=0.585 (USD); Color: Black; Packaging: Tray; Series: D6; Termination Style: Solder Pin; Brand: C&K Components; Mounting Style: Through Hole; Standard Pack Qty: 250; RoHS - Mouser: Y; Minimum Order Quantity: 1; Reeling: False; ComponentLink1URL: http://www.mouser.com/ds/2/60/-19155.pdf; ComponentLink1Description: http://www.mouser.com/ds/2/60/-19155.pdf
Q9 = MMBF4391LT1: JFET Switching Transistor, N-Channel, 3-Pin SOT-23, Tape and Reel; Manufacturer: On Semiconductor; Channel Polarity: N Channel; Ciss Max (pF): 14; Crss Max (pF): 3.5; IDSS Max (uA): 150000; IDSS Min (uA): 50000; V(BR)GSS Min (V): 30; Vds - Drain-Source Breakdown Voltage: 30 V; DatasheetVersion: Rev. 10; PackageVersion: Rev. AP, 11/2009; PackageReference: SOT-23-3-318-08; PackageDescription: 3-Pin Small Outline Transistor, Body 2.92 x 1.3 mm, Pitch 0.95 mm; Supplier 1: Mouser; Supplier Part Number 1: 863-MMBF4391LT1G; Packing: Tape and Reel; Mounting Technology: Surface Mount; PartNumber: MMBF4391LT1; ComponentLink1Description: Manufacturer URL; ComponentLink1URL: http://www.onsemi.com/; ComponentLink2Description: Datasheet; ComponentLink2URL: http://www.onsemi.com/pub_link/Collateral/MMBF4391LT1-D.PDF; ComponentLink3Description: Package Specification; ComponentLink3URL: http://www.onsemi.cn/pub_link/Collateral/318-08.PDF; Supplier 2: Mouser; Supplier Part Number 2: 863-MMBF4391LT1G; Transistor Polarity: N-Channel
Q10 = MMBT3906TT1G: General Purpose Transistor, PNP Silicon, 3-Pin SC-75, Pb-Free, Tape and Reel; Manufacturer: On Semiconductor; fT Min (MHz): 250; IC Continuous (A): -0.2; Collector- Base Voltage VCBO: - 40 V; Configuration: Single; Emitter- Base Voltage VEBO: 5 V; Collector-Emitter Saturation Voltage: - 0.4 V; Continuous Collector Current: - 0.2 A; DC Collector/Base Gain hfe Min: 60; Gain Bandwidth Product fT: 250 MHz; Maximum DC Collector Current: 0.2 A; Pd - Power Dissipation: 225 mW; DatasheetVersion: Rev. 1; PackageVersion: Rev. F, 07/2005; PackageReference: SC-75-3-463-01; PackageDescription: 3-Pin Small Outline Transistor, Body 1.6 x 0.8 mm, Pitch 0.5 mm; Supplier 1: Mouser; Supplier Part Number 1: 863-MMBT3906TT1G; Packing: Tape and Reel; Polarity: PNP; RoHS: TRUE; Mounting Technology: Surface Mount; PartNumber: MMBT3906TT1G; ComponentLink1Description: Manufacturer URL; ComponentLink1URL: http://www.onsemi.com/; ComponentLink2Description: Datasheet; ComponentLink2URL: http://www.onsemi.cn/pub_link/Collateral/MMBT3906TT1-D.PDF; ComponentLink3Description: Package Specification; ComponentLink3URL: http://www.onsemi.com/pub_link/Collateral/463-01.PDF; Manufacturer Part Number: MMBT3906TT1G; Category: Bipolar Transistors - BJT; Stock 8: 24746; Pricing 8: 1=0.150, 10=0.130, 100=0.046, 1000=0.031, 3000=0.024, 9000=0.021, 24000=0.019, 45000=0.017, 99000=0.014 (USD); Collector- Emitter Voltage VCEO Max: - 40 V; Height: 0.75 mm; Length: 1.6 mm; Package / Case: SC-75-3; Packaging: Reel; Series: MMBT3906T; Brand: ON Semiconductor; Mounting Style: SMD/SMT; Maximum Operating Temperature: + 150 C; Minimum Operating Temperature: - 55 C; Standard Pack Qty: 3000; RoHS - Mouser: Y; Minimum Order Quantity: 1; Reeling: True; ComponentLink4URL: http://www.mouser.com/ds/2/308/MMBT3906TT1-D-110239.pdf; ComponentLink4Description: http://www.mouser.com/ds/2/308/MMBT3906TT1-D-110239.pdf
R50 = Res1: Resistor; Manufacturer: KOA Speer; Manufacturer Part Number: CF1/2C821J; Power Rating: 500 mW (1/2 W); Resistance: 820 Ohms; Temperature Coefficient: - 450 PPM / C, + 350 PPM / C; Tolerance: 5 %; Voltage Rating: 400 V; Qualification: AEC-Q200; Published: 8-Jun-2000; LatestRevisionDate: 17-Jul-2002; LatestRevisionNote: Re-released for DXP Platform.; PackageReference: AXIAL-0.3; Publisher: Altium Limited; PackageDescription: Axial Device, Thru-Hole; 2 Leads; 0.3 in Pin Spacing; Supplier 1: Mouser; RoHS: RoHS Compliant; Category: Carbon Film Resistors - Through Hole; Stock 1: 13076; Pricing 1: 1=0.370, 100=0.058, 500=0.035, 1000=0.025, 5000=0.020, 10000=0.018, 25000=0.015, 50000=0.013, 100000=0.012 (USD); Diameter: 3 mm; Length: 8.5 mm; Operating Temperature Range: - 55 C to + 155 C; Packaging: Bulk; Series: CF; Termination Style: Axial; Type: Carbon Film Leaded Resistor; Brand: KOA Speer; Standard Pack Qty: 1000; RoHS - Mouser: Y; Minimum Order Quantity: 1; Reeling: False; ComponentLink1URL: http://www.mouser.com/ds/2/219/CF-6922.pdf; ComponentLink1Description: http://www.mouser.com/ds/2/219/CF-6922.pdf
R51 R53 = Potentiometer: My Own; Manufacturer: Alpha (Taiwan); Manufacturer Part Number: RV16AF-10-20R1-A1M-LA; Power Rating: 125 mW (1/8 W); Resistance: 1 MOhms; Tolerance: 30 %; Element Type: Carbon; Number of Gangs: 1 Gang; Number of Turns: 1 Turn; Shaft Diameter: 0.25 in; Shaft Length: 20 mm (0.7874 in); Shaft Type: Round; Supplier 1: Mouser; RoHS: RoHS Compliant; Category: Potentiometers; Stock 1: 595; Pricing 1: 1=1.61, 25=1.38, 50=1.23, 100=1.11, 500=0.910, 1000=0.850, 2500=0.790, 5000=0.720, 10000=0.670 (USD); Product: Potentiometer; Termination Style: Solder Lug; Type: Rotary; Brand: Alpha (Taiwan); Mounting Style: Panel Mount; Standard Pack Qty: 1000; Taper: Audio; RoHS - Mouser: Y; Minimum Order Quantity: 1; Reeling: False
  R53: Value: 1M
R52 R61 R62 = Res1: Metal Film Resistors - Through Hole 1/4watt 10Kohms 5% Rated to 1/2watt; Manufacturer Part Number: CCF0710K0JKE36; Brand: Vishay / Dale; Lead Diameter: 0.6 mm; Power Rating: 250 mW (1/4 W), 500 mW (1/2 W); Temperature Coefficient: 100 PPM / K; Voltage Rating: 250 V; Published: 8-Jun-2000; LatestRevisionDate: 17-Jul-2002; LatestRevisionNote: Re-released for DXP Platform.; PackageReference: AXIAL-0.3; Publisher: Altium Limited; PackageDescription: Axial Device, Thru-Hole; 2 Leads; 0.3 in Pin Spacing; Value: 10K; Category: Metal Film Resistors - Through Hole; ComponentLink1Description: http://www.mouser.com/ds/2/427/ccf07-239748.pdf; ComponentLink1URL: http://www.mouser.com/ds/2/427/ccf07-239748.pdf; Diameter: 2.29 mm; Length: 6.22 mm; Manufacturer: Vishay / Dale; Minimum Order Quantity: 1; Operating Temperature Range: - 65 C to + 150 C; Packaging: Reel; Pricing 1: 1=0.100, 100=0.037, 1000=0.033, 2000=0.030, 5000=0.026, 10000=0.020, 25000=0.015, 50000=0.013, 100000=0.012 (USD); Product: Metal Film Resistors - Through Hole; Reeling: True; Resistance: 10 kOhms; RoHS - Mouser: Y; RoHS: RoHS Compliant; Series: CCF07; Standard Pack Qty: 5000; Stock 1: 48658; Supplier 1: Mouser; Termination Style: Axial; Tolerance: 5 %; Type: Metal Film Resistors, Industrial
  R52: Supplier Part Number 1: 71-CMF5510K000BEEA; Supplier 2: Mouser; Stock 2: 4124; Pricing 2: 1=0.610, 5000=0.249, 10000=0.242, 20000=0.236, 50000=0.234 (USD); ComponentLink2URL: http://www.mouser.com/ds/2/427/cmfind-239942.pdf; ComponentLink2Description: http://www.mouser.com/ds/2/427/cmfind-239942.pdf
  R61 R62: Supplier Part Number 1: 71-CCF0710K0JKE36
R54 = Res1: Resistor; Manufacturer Part Number: CCF074K70JKE36; Brand: Vishay / Dale; Lead Diameter: 0.6 mm; Power Rating: 250 mW (1/4 W), 500 mW (1/2 W); Resistance: 4.7 kOhms; Temperature Coefficient: 100 PPM / K; Tolerance: 5 %; Voltage Rating: 250 V; Published: 8-Jun-2000; LatestRevisionDate: 17-Jul-2002; LatestRevisionNote: Re-released for DXP Platform.; PackageReference: AXIAL-0.3; Publisher: Altium Limited; PackageDescription: Axial Device, Thru-Hole; 2 Leads; 0.3 in Pin Spacing; Value: 4.7K; Category: Metal Film Resistors - Through Hole; ComponentLink1Description: http://www.mouser.com/ds/2/427/ccf07-239748.pdf; ComponentLink1URL: http://www.mouser.com/ds/2/427/ccf07-239748.pdf; Diameter: 2.29 mm; Length: 6.22 mm; Manufacturer: Vishay / Dale; Minimum Order Quantity: 1; Operating Temperature Range: - 65 C to + 150 C; Packaging: Reel; Pricing 1: 1=0.100, 100=0.040, 1000=0.030, 2000=0.027, 5000=0.025, 10000=0.022, 25000=0.020, 50000=0.018, 100000=0.016 (USD); Product: Metal Film Resistors - Through Hole; Reeling: True; RoHS - Mouser: Y; RoHS: RoHS Compliant; Series: CCF07; Standard Pack Qty: 5000; Stock 1: 32326; Supplier 1: Mouser; Supplier Part Number 1: 71-CCF07-J-4.7K-E3; Termination Style: Axial; Type: Metal Film Resistors, Industrial
R57 = Res1: Resistor; Manufacturer: Vishay / Dale; Manufacturer Part Number: CMF50200R00FHEB; Power Rating: 250 mW (1/4 W); Resistance: 200 Ohms; Temperature Coefficient: 50 PPM / C; Tolerance: 1 %; Voltage Rating: 200 V; Lead Diameter: 0.41 mm; Published: 8-Jun-2000; LatestRevisionDate: 17-Jul-2002; LatestRevisionNote: Re-released for DXP Platform.; PackageReference: AXIAL-0.3; Publisher: Altium Limited; PackageDescription: Axial Device, Thru-Hole; 2 Leads; 0.3 in Pin Spacing; Value: 200; Supplier 1: Mouser; RoHS: RoHS Compliant; Category: Metal Film Resistors - Through Hole; Stock 1: 881; Pricing 1: 1=0.390, 50=0.338, 100=0.278, 500=0.242, 1000=0.217, 2000=0.193, 5000=0.187, 10000=0.181, 25000=0.175 (USD); Diameter: 1.65 mm; Length: 3.81 mm; Operating Temperature Range: - 55 C to + 175 C; Packaging: Reel; Product: Metal Film Resistors Controlled Temp Coefficient; Series: CMF Industrial; Termination Style: Axial; Type: Metal Film Resistors, Industrial, Precision; Brand: Vishay / Dale; Standard Pack Qty: 1000; RoHS - Mouser: Y; Minimum Order Quantity: 1; Reeling: True; ComponentLink1URL: http://www.mouser.com/ds/2/427/cmfind-239942.pdf; ComponentLink1Description: http://www.mouser.com/ds/2/427/cmfind-239942.pdf
R58 = Res1: as R44 on sheet VCLPF; Published: 8-Jun-2000; LatestRevisionDate: 17-Jul-2002; LatestRevisionNote: Re-released for DXP Platform.; PackageReference: AXIAL-0.3; Publisher: Altium Limited; PackageDescription: Axial Device, Thru-Hole; 2 Leads; 0.3 in Pin Spacing; Value: 100K; Category: Metal Film Resistors - Through Hole; ComponentLink1Description: http://www.mouser.com/ds/2/427/cmfind-239942.pdf; ComponentLink1URL: http://www.mouser.com/ds/2/427/cmfind-239942.pdf; Diameter: 2.29 mm; Length: 6.1 mm; Manufacturer: Vishay / Dale; Minimum Order Quantity: 1; Operating Temperature Range: - 55 C to + 175 C; Packaging: Bulk; Pricing 1: 1=0.230, 25=0.181, 100=0.132, 500=0.115, 1000=0.099, 2000=0.092, 5000=0.087, 10000=0.082, 25000=0.072 (USD); Product: Metal Film Resistors Controlled Temp Coefficient; Reeling: False; RoHS - Mouser: Y; RoHS: RoHS Compliant; Series: CMF Industrial; Standard Pack Qty: 100; Stock 1: 4041; Supplier 1: Mouser; Supplier Part Number 1: 71-CMF55100K00FHEK; Termination Style: Axial; Type: Metal Film Resistors, Industrial, Precision; Supplier Part Number 2: 71-CMF50100K00FHEB
R63 R64 = Res1: Resistor; Manufacturer: Vishay / Dale; Manufacturer Part Number: CMF55150K00DHR6; Power Rating: 500 mW (1/2 W); Resistance: 150 kOhms; Temperature Coefficient: 50 PPM / C; Tolerance: 0.5 %; Voltage Rating: 250 V; Published: 8-Jun-2000; LatestRevisionDate: 17-Jul-2002; LatestRevisionNote: Re-released for DXP Platform.; PackageReference: AXIAL-0.3; Publisher: Altium Limited; PackageDescription: Axial Device, Thru-Hole; 2 Leads; 0.3 in Pin Spacing; Value: 150K; Supplier 1: Mouser; RoHS: No; Category: Metal Film Resistors - Through Hole; Stock 1: 987; Pricing 1: 1=0.230, 50=0.225, 100=0.220, 500=0.193, 1000=0.181, 4000=0.171, 8000=0.160, 12000=0.146, 20000=0.135 (USD); Diameter: 2.29 mm; Length: 6.1 mm; Operating Temperature Range: - 55 C to + 175 C; Packaging: Reel; Product: Metal Film Resistors Controlled Temp Coefficient; Series: CMF Industrial; Termination Style: Axial; Type: Metal Film Resistors, Industrial, Precision; Brand: Vishay / Dale; Standard Pack Qty: 1000; RoHS - Mouser: N; Minimum Order Quantity: 1; Reeling: True; ComponentLink1URL: http://www.mouser.com/ds/2/427/cmfind-239942.pdf; ComponentLink1Description: http://www.mouser.com/ds/2/427/cmfind-239942.pdf
S8 = SPDT Switch: as S3 on sheet VCLPF; Supplier 1: Mouser; Manufacturer Part Number: 108-MS550A; RoHS: No; Category: Toggle Switches; Stock 1: 531; Pricing 1: 1=2.15, 50=2.09, 100=2.03, 500=1.97, 1000=1.80, 2000=1.71, 5000=1.63 (USD); Contact Form: SPDT; Contact Plating: Gold; Mounting Type: Bushing; Packaging: Bulk; Series: 108; Terminal Seal: Sealed; Termination Style: Solder Lug; Type: Toggle Switches; Brand: Mountain Switch; Contact Material: Nickel; Mounting Style: Panel; Standard Pack Qty: 100; RoHS - Mouser: N; Minimum Order Quantity: 1; Reeling: False; ComponentLink1URL: http://www.mouser.com/ds/2/221/MS-200272-200731.pdf; ComponentLink1Description: http://www.mouser.com/ds/2/221/MS-200272-200731.pdf
U2 = LM324J: as U2 on sheet VCLPF; DatasheetVersion: Aug-2000; PackageVersion: revJ, Jul-2002; PackageReference: J14A; PackageDescription: Cerdip, .400 x .310in Body, 14 Lead, .300in Centers, .100in Pitch; PartNumber: LM324J; RoHS: N; PinCount: 14; ComponentLink1Description: Manufacturer URL; ComponentLink1URL: http://www.national.com/; ComponentLink2Description: LM324 Datasheet; ComponentLink2URL: http://www.national.com/ds/LM/LM324.pdf; ComponentLink3Description: LM324 Web Page; ComponentLink3URL: http://www.national.com/pf/LM/LM324.html; ComponentLink4Description: J14A Package Page; ComponentLink4URL: http://www.national.com/packaging/folders/j14a.html; Supplier 1: Mouser; Supplier Part Number 1: 512-LM324N
X17-X19 X21 = Pad